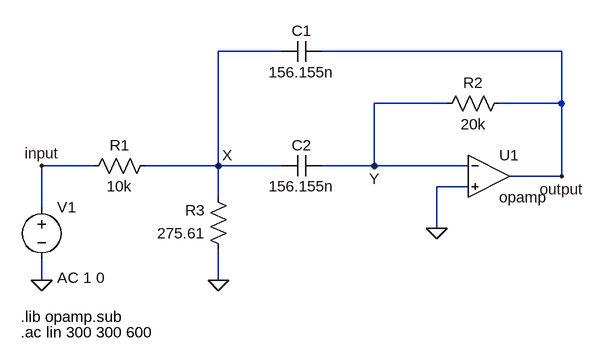
[diagram p0: schematic filter.asc]
filter.asc, the LTspice schematic file:
Version 4
SHEET 1 880 680
WIRE -192 64 -288 64
WIRE 240 64 -128 64
WIRE 64 144 -48 144
WIRE 240 144 240 64
WIRE 240 144 144 144
WIRE -480 240 -560 240
WIRE -288 240 -288 64
WIRE -288 240 -400 240
WIRE -192 240 -288 240
WIRE -48 240 -48 144
WIRE -48 240 -128 240
WIRE 96 240 -48 240
WIRE 240 256 240 144
WIRE 240 256 160 256
WIRE 96 272 48 272
WIRE -288 288 -288 240
WIRE -560 304 -560 240
WIRE 48 336 48 272
WIRE -560 416 -560 384
WIRE -288 416 -288 368
FLAG -288 416 0
FLAG 48 336 0
FLAG -560 416 0
FLAG 240 256 output
FLAG -560 240 input
FLAG -288 240 X
FLAG -48 240 Y
SYMBOL OpAmps\\opamp 128 192 R0
SYMATTR InstName U1
SYMBOL cap -128 224 R90
WINDOW 0 0 32 VBottom 2
WINDOW 3 32 32 VTop 2
SYMATTR InstName C2
SYMATTR Value 156.155n
SYMBOL cap -128 48 R90
WINDOW 0 0 32 VBottom 2
WINDOW 3 32 32 VTop 2
SYMATTR InstName C1
SYMATTR Value 156.155n
SYMBOL res 160 128 R90
WINDOW 0 0 56 VBottom 2
WINDOW 3 32 56 VTop 2
SYMATTR InstName R2
SYMATTR Value 20k
SYMBOL res -272 384 R180
WINDOW 0 36 76 Left 2
WINDOW 3 36 40 Left 2
SYMATTR InstName R3
SYMATTR Value 275.61
SYMBOL res -496 256 R270
WINDOW 0 32 56 VTop 2
WINDOW 3 0 56 VBottom 2
SYMATTR InstName R1
SYMATTR Value 10k
SYMBOL voltage -560 288 R0
WINDOW 123 24 124 Left 2
WINDOW 39 0 0 Left 0
SYMATTR Value2 AC 1 0
SYMATTR InstName V1
SYMATTR Value ""
TEXT -592 472 Left 2 !.lib opamp.sub
TEXT -592 496 Left 2 !.ac lin 300 300 600

The netlist it stands for:
* filter.asc
XU1 Y 0 output opamp Aol=100K GBW=10Meg  ; pins invin noninvin out
C2 Y X 156.155n
C1 output X 156.155n
R2 output Y 20k
R3 0 X 275.61
R1 input X 10k
V1 input 0 AC 1 0
.lib opamp.sub
.ac lin 300 300 600
.backanno
.end